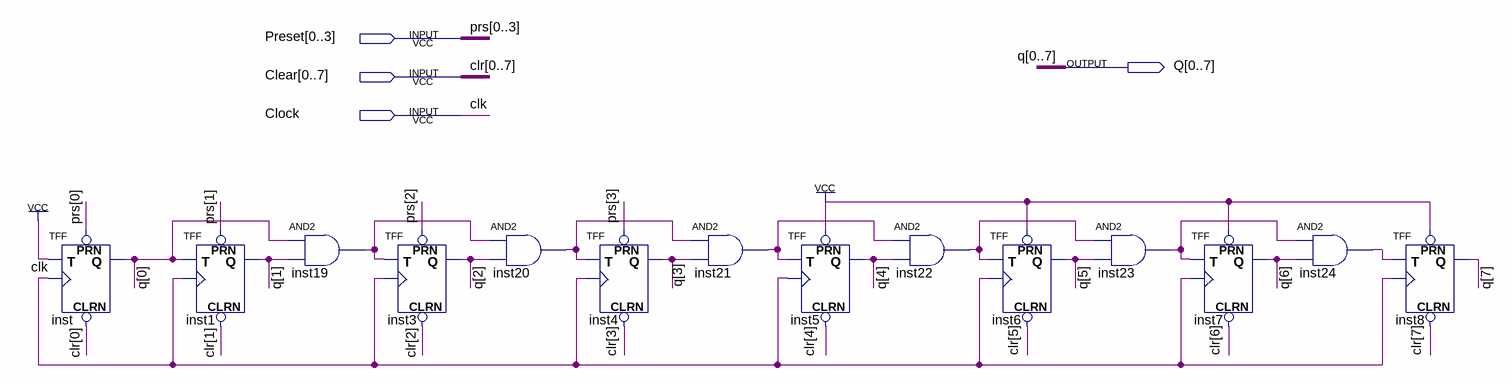
[diagram p0: schematic sheet]
// Quartus schematic counter.bdf as structural Verilog: 14 symbols, 4 pins
module counter (
  input  [0:3] Preset,
  input  [0:7] Clear,
  input  Clock,
  output [0:7] Q
);

  wire inst19_out, inst20_out, inst21_out, inst22_out, inst23_out, inst24_out;

  TFF inst (.PRN(Preset[0]), .CLRN(Clear[0]), .T(1'b1), .CLK(Clock), .Q(Q[0]));
  TFF inst1 (.PRN(Preset[1]), .CLRN(Clear[1]), .T(Q[0]), .CLK(Clock), .Q(Q[1]));
  and inst19 (inst19_out, Q[0], Q[1]);
  TFF inst3 (.PRN(Preset[2]), .CLRN(Clear[2]), .T(inst19_out), .CLK(Clock), .Q(Q[2]));
  and inst20 (inst20_out, inst19_out, Q[2]);
  TFF inst4 (.PRN(Preset[3]), .CLRN(Clear[3]), .T(inst20_out), .CLK(Clock), .Q(Q[3]));
  and inst21 (inst21_out, inst20_out, Q[3]);
  TFF inst5 (.PRN(1'b1), .CLRN(Clear[4]), .T(inst21_out), .CLK(Clock), .Q(Q[4]));
  and inst22 (inst22_out, inst21_out, Q[4]);
  TFF inst6 (.PRN(1'b1), .CLRN(Clear[5]), .T(inst22_out), .CLK(Clock), .Q(Q[5]));
  and inst23 (inst23_out, inst22_out, Q[5]);
  TFF inst7 (.PRN(1'b1), .CLRN(Clear[6]), .T(inst23_out), .CLK(Clock), .Q(Q[6]));
  and inst24 (inst24_out, inst23_out, Q[6]);
  TFF inst8 (.PRN(1'b1), .CLRN(Clear[7]), .T(inst24_out), .CLK(Clock), .Q(Q[7]));

  // Other names for the same wires on the sheet: clk = Clock;
  //   clr[7:0] = {Clear[7], Clear[6], Clear[5], Clear[4], Clear[3], Clear[2], Clear[1], Clear[0]};
  //   prs[3:0] = {Preset[3], Preset[2], Preset[1], Preset[0]}
endmodule
